# EAGLE design Ad8232_placa_V2 (EAGLE 9.6.2)
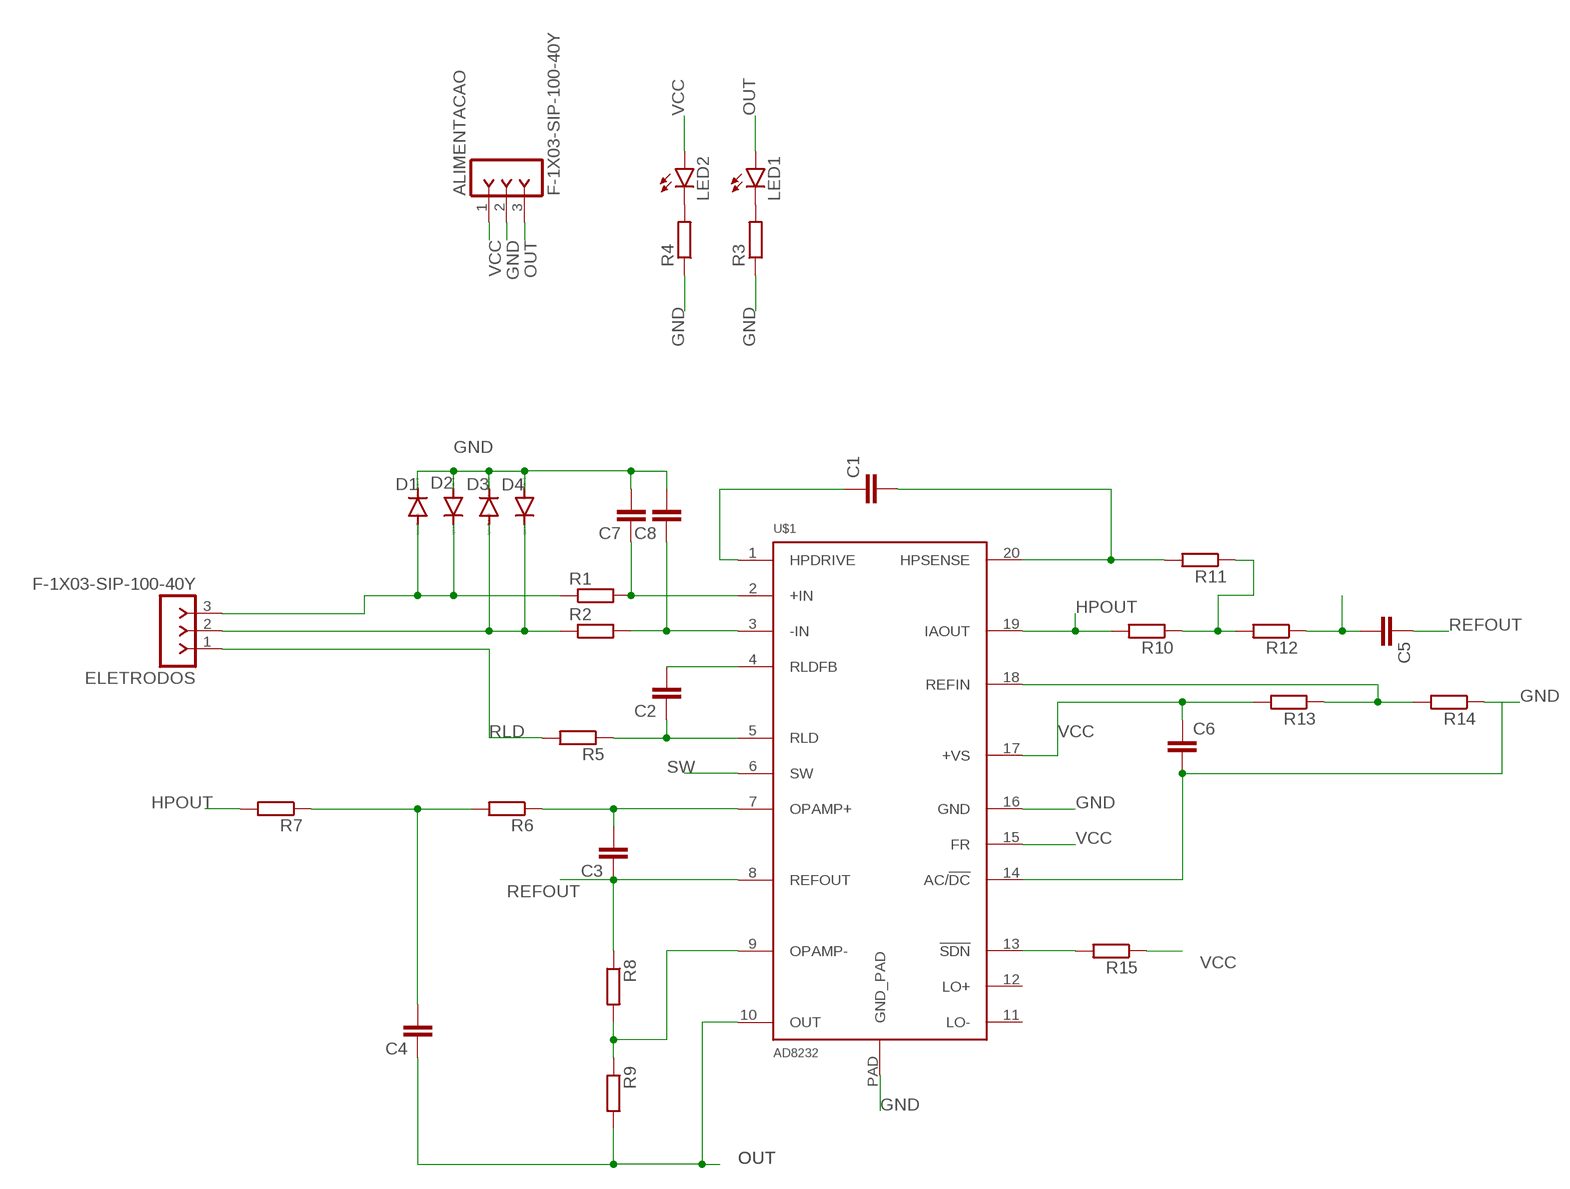
[diagram p0: schematic, sheet 1]

## Parts
ALIMENTACAO  F-1X03-SIP-100-40Y  [SIP-100-03-40Y]
C1  C-EUC0805  [C0805]
C2  C-EUC0805  [C0805]
C3  C-EUC0805  [C0805]
C4  C-EUC0805  [C0805]
C5  C-EUC0805  [C0805]
C6  C-EUC0805  [C0805]
C7  C-EUC0805  [C0805]
C8  C-EUC0805  [C0805]
D1  DIODE-MINIMELF  [MINIMELF]
D2  DIODE-MINIMELF  [MINIMELF]
D3  DIODE-MINIMELF  [MINIMELF]
D4  DIODE-MINIMELF  [MINIMELF]
ELETRODOS  F-1X03-SIP-100-40Y  [SIP-100-03-40Y]
LED1  LEDCHIPLED_0603  [CHIPLED_0603]
LED2  LEDCHIPLED_0603  [CHIPLED_0603]
R1  R-EU_R0805  [R0805]
R2  R-EU_R0805  [R0805]
R3  R-EU_R0805  [R0805]
R4  R-EU_R0805  [R0805]
R5  R-EU_R0805  [R0805]
R6  R-EU_R0805  [R0805]
R7  R-EU_R0805  [R0805]
R8  R-EU_R0805  [R0805]
R9  R-EU_R0805  [R0805]
R10  R-EU_R0805  [R0805]
R11  R-EU_R0805  [R0805]
R12  R-EU_R0805  [R0805]
R13  R-EU_R0805  [R0805]
R14  R-EU_R0805  [R0805]
R15  R-EU_R0805  [R0805]
U$1  AD8232  [LFCSP_20]

## Nets
GND: ALIMENTACAO.2 C6.2 C7.2 C8.2 D1.C D2.A D3.C D4.A R3.1 R4.1 R14.1 U$1.14(AC/!DC) U$1.16(GND) U$1.PAD(GND_PAD)
HPOUT: R7.2 R10.2 U$1.19(IAOUT)
N$1: C1.1 U$1.1(HPDRIVE)
N$2: C1.2 R11.2 U$1.20(HPSENSE)
N$3: C7.1 R1.2 U$1.2(+IN)
N$4: C8.1 R2.2 U$1.3(-IN)
N$5: D1.A D2.C ELETRODOS.3 R1.1
N$6: D3.A D4.C ELETRODOS.2 R2.1
N$7: C2.2 U$1.4(RLDFB)
N$8: C2.1 R5.1 U$1.5(RLD)
N$9: C3.2 R6.1 U$1.7(OPAMP+)
N$10: R13.1 R14.2 U$1.18(REFIN)
N$11: R8.2 R9.1 U$1.9(OPAMP-)
N$12: LED1.C R3.2
N$13: R10.1 R11.1 R12.2
N$14: C4.2 R6.2 R7.1
N$15: LED2.C R4.2
N$16: R15.2 U$1.13(!SDN)
OUT: ALIMENTACAO.3 C4.1 LED1.A R9.2 U$1.10(OUT)
REFOUT: C3.1 C5.1 R8.1 U$1.8(REFOUT)
RLD: ELETRODOS.1 R5.2
SW: C5.2 R12.1 U$1.6(SW)
VCC: ALIMENTACAO.1 C6.1 LED2.A R13.2 R15.1 U$1.15(FR) U$1.17(+VS)
Unconnected: U$1.11(LO-) U$1.12(LO+)

## Library data of the parts
ALIMENTACAO ELETRODOS = con-headers-jp:F-1X03-: FEMALE HEADER
C1-C8 = rcl:C-EU: CAPACITOR, European symbol
D1-D4 = diode:DIODE-: DIODE
LED1 LED2 = led:LED: LED OSRAM: - CHIPLED LG R971, LG N971, LY N971, LG Q971, LY Q971, LO R971, LY R971 LH N974, LH R974 LS Q976, LO Q976, LY Q976 LO Q996 - Hyper CHIPLED LW Q18S LB Q993, LB Q99A, LB R99A - SideLED LS A670, LO A670, LY A670, LG A670, LP A670 LB A673, LV A673, LT A673, LW A673 LH A674 LY A675 LS A676, LA A676, LO A676, LY A676, LW A676 LS A679, LY A679, LG A679 - Hyper Micro SIDELED® LS Y876, LA Y876, LO Y876, LY Y876 LT Y87S - SmartLED LW L88C, LW L88S LB L89C, LB L89S, LG L890 LS L89K, LO L89K, LY L89K LS L896, LA L896, LO L896, LY L896 - TOPLED LS T670, LO T670, LY T670, LG T670, LP T670 LSG T670, LSP T670, LSY T670, LOP T670, LYG T670 LG T671, LOG T671, LSG T671 LB T673, LV T673, LT T673, LW T673 LH T674 LS T676, LA T676, LO T676, LY T676, LB T676, LH T676, LSB T676, LW T676 LB T67C, LV T67C, LT T67C, LS T67K, LO T67K, LY T67K, LW E67C LS E67B, LA E67B, LO E67B, LY E67B, LB E67C, LV E67C, LT E67C LW T67C LS T679, LY T679, LG T679 LS T770, LO T770, LY T770, LG T770, LP T770 LB T773, LV T773, LT T773, LW T773 LH T774 LS E675, LA E675, LY E675, LS T675 LS T776, LA T776, LO T776, LY T776, LB T776 LHGB T686 LT T68C, LB T68C - Hyper Mini TOPLED® LB M676 - Mini TOPLED Santana® LG M470 LS M47K, LO M47K, LY M47K Source: http://www.osram.convergy.de LUXEON: - LUMILED® LXK2-PW12-R00, LXK2-PW12-S00, LXK2-PW14-U00, LXK2-PW14-V00 LXK2-PM12-R00, LXK2-PM12-S00, LXK2-PM14-U00 LXK2-PE12-Q00, LXK2-PE12-R00, LXK2-PE12-S00, LXK2-PE14-T00, LXK2-PE14-U00 LXK2-PB12-K00, LXK2-PB12-L00, LXK2-PB12-M00, LXK2-PB14-N00, LXK2-PB14-P00, LXK2-PB14-Q00 LXK2-PR12-L00, LXK2-PR12-M00, LXK2-PR14-Q00, LXK2-PR14-R00 LXK2-PD12-Q00, LXK2-PD12-R00, LXK2-PD12-S00 LXK2-PH12-R00, LXK2-PH12-S00 LXK2-PL12-P00, LXK2-PL12-Q00, LXK2-PL12-R00 Source: www.luxeon.com KINGBRIGHT: KA-3528ASYC Source: www.kingbright.com
R1-R15 = rcl:R-EU_: RESISTOR, European symbol
U$1 = AD8232:AD8232: Check prices <https://pricing.snapeda.com/parts/AD8232/Analog%20Devices/view-part?ref=eda>; AVAILABILITY: Not in stock; DESCRIPTION: AD8232 Sensor Signal Conditioner Interface Evaluation Board; MF: Analog Devices; MP: AD8232; PACKAGE: LFCSP-20 Analog Devices; PRICE: None

## Board
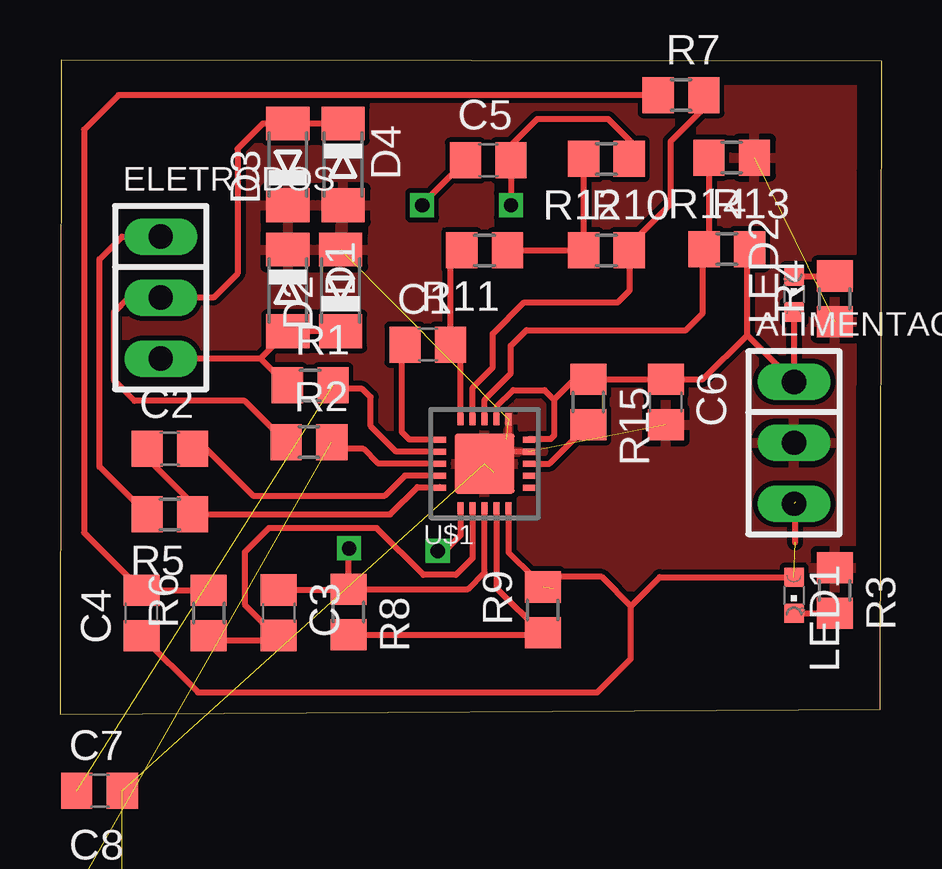
[diagram p1: board, top side]
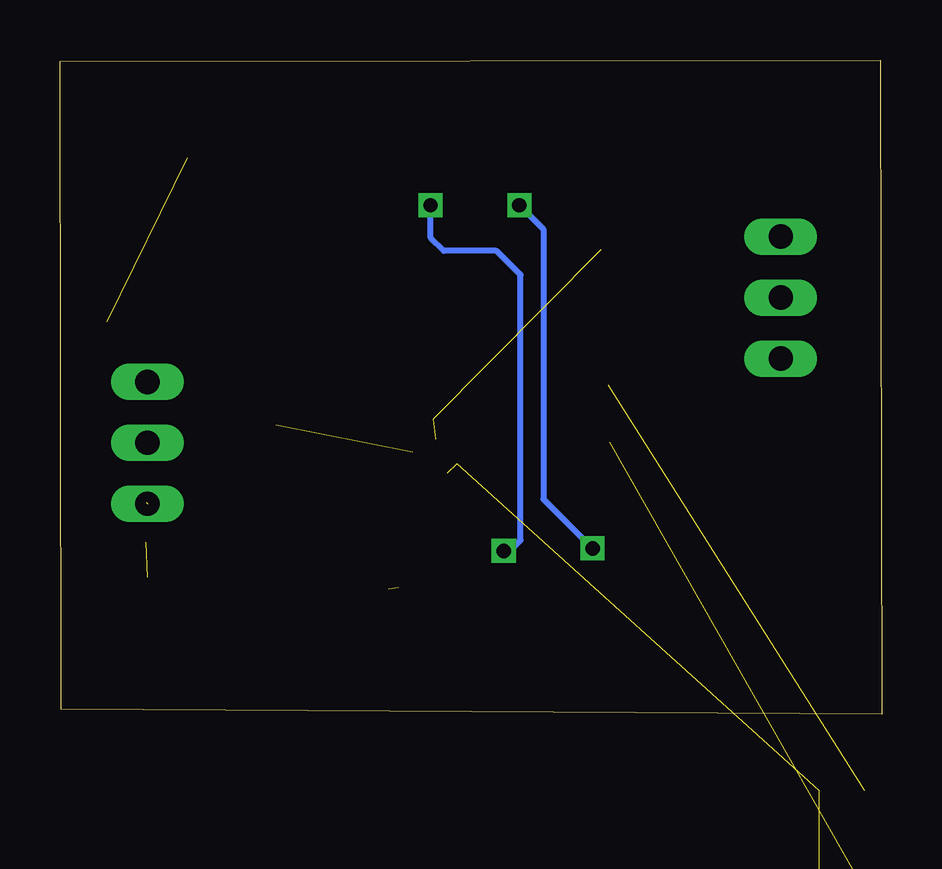
[diagram p2: board, bottom side, seen from below]

Size 34.25 x 27.25 mm. Coordinates in mm from the lower left corner, seen from the top.
Outline: 0,0 34.2,0.2 34.25,27.2 0.05,27.25 0,0
Copper layers (1*16): Top 0.035mm / dielectric 1.5mm / Bottom 0.035mm
Design rules "default": minimum track width 10mil, minimum drill 24mil, track to track 8mil, track to pad 8mil, pad to pad 8mil, via to via 8mil, smd to smd 8mil, copper to edge 40mil, drill to drill 8mil, minimum pad ring 10mil, minimum via ring 8mil, stop-mask expansion 4mil, vias tented up to drill 0mil, thermal gap 10mil

### Footprints (pad centres in the part's own frame; a part is rotated, then mirrored left to right if it is on the bottom)
SIP-100-03-40Y = drill 1.016 long: 1 -2.54,0; 2 0,0; 3 2.54,0
C0805 = smd 1.3 x 1.5: 1 -0.95,0; 2 0.95,0
MINIMELF = smd 1.4 x 1.8: A 1.7,0; C -1.7,0
CHIPLED_0603 = smd 0.8 x 0.8: A 0,-0.75; C 0,0.75
R0805 = smd 1.3 x 1.5: 1 -0.95,0; 2 0.95,0
LFCSP_20 = smd 0.5 x 0.25: 1 -1.85,1; 2 -1.85,0.5; 3 -1.85,0; 4 -1.85,-0.5; 5 -1.85,-1; 11 1.85,-1; 12 1.85,-0.5; 13 1.85,0; 14 1.85,0.5; 15 1.85,1 | smd 0.25 x 0.5: 6 -1,-1.85; 7 -0.5,-1.85; 8 0,-1.85; 9 0.5,-1.85; 10 1,-1.85; 16 1,1.85; 17 0.5,1.85; 18 0,1.85; 19 -0.5,1.85; 20 -1,1.85 | smd 2.5 x 2.5: PAD 0,0

### Placement (x,y rotation side)
ALIMENTACAO  30.6,11.3 270 top
C1  15.33,15.39 0 top
C2  4.58,11.05 0 top
C3  9.12,4.22 270 top
C4  3.4,4.21 90 top
C5  17.85,23.07 0 top
C6  25.25,13 270 top
C7  1.65,-3.2 0 top  (outside the outline)
C8  1.65,-7.35 0 top  (outside the outline)
D1  9.5,17.65 270 top
D2  11.7,17.65 90 top
D3  9.5,22.9 90 top
D4  11.8,22.9 270 top
ELETRODOS  4.2,17.35 270 top
LED1  30.6,4.95 180 top
LED2  30.6,17.5 0 top
R1  10.43,13.69 0 top
R2  10.38,11.33 0 top
R3  32.3,5.15 270 top
R4  32.3,17.3 90 top
R5  4.58,8.32 180 top
R6  6.2,4.21 90 top
R7  25.89,25.79 0 top
R8  12.03,4.25 270 top
R9  20.13,4.34 90 top
R10  22.78,19.32 0 top
R11  17.7,19.32 180 top
R12  22.78,23.13 180 top
R13  27.8,19.37 0 top
R14  28,23.18 180 top
R15  22.03,13 270 top
U$1  17.7,10.43 0 top

### Tracks (layer width: path | path; a pad name or v marks a point on that pad's centre or on a via)
GND  (7 unrouted)
  Top 0.254: 18.6,11.45 18.5,11.35 | 18.1,10.05 18.1,10.7 18.33,10.93 U$1.14 | U$1.16 18.7,11.43 U$1.PAD
  pour Top: -0.25,27.3 34.3,27.3 34.3,0.15 -0.25,0.15
HPOUT
  Top 0.254: U$1.19 17.2,13.6 18.05,14.45 18.05,15.85 19.35,17.15 23.25,17.15 23.75,17.65 23.75,19.3 R10.2 23.65,19.4 23.65,19.45 25.45,21.25 25.45,23.85 26.84,25.24 R7.2
N$1
  Top 0.254: U$1.1 14.57,11.43 14.25,11.75 14.25,15.26 C1.1
N$2
  Top 0.254: U$1.20 16.7,14.97 C1.2 16.28,18.85 R11.2
N$3  (1 unrouted)
  Top 0.254: U$1.2 14.02,10.93 12.95,12 12.95,13.2 12.6,13.55 11.52,13.55 R1.2
N$4  (1 unrouted)
  Top 0.254: U$1.3 13.27,10.43 12.65,11.05 11.61,11.05 R2.2
N$5
  Top 0.254: 8.35,14.81 8.36,14.81 R1.1 | 8.35,14.81 ELETRODOS.3 | D2.C D1.A 8.35,14.81
N$6
  Top 0.254: R2.1 7.7,13.05 3.1,13.05 2.25,13.9 2.25,16.75 2.85,17.35 ELETRODOS.2 6.4,17.35 7.4,18.35 7.4,23.55 8.45,24.6 D3.A D4.C
N$7
  Top 0.254: C2.2 6.1,11.05 8.05,9.1 13.55,9.1 14.38,9.93 U$1.4
N$8
  Top 0.254: U$1.5 15.83,9.45 14.9,9.45 13.77,8.32 R5.1 5.53,8.77 3.6,10.7 3.6,11.02 C2.1
N$9
  Top 0.254: R6.1 6.4,3.06 9.2,3.06 | 9.2,3.06 9.3,3.06 9.3,3.09 C3.2 | U$1.7 17.2,6.5 16.5,5.8 15.15,5.8 13.2,7.75 8.7,7.75 7.7,6.75 7.7,4.56 9.2,3.06
N$10
  Top 0.254: R14.2 27.05,19.57 R13.1 26.8,19.32 26.8,16.7 26.1,16 19.45,16 18.8,15.35 18.8,14.2 17.7,13.1 U$1.18
N$11
  Top 0.254: R8.2 20.04,3.3 20.09,3.35 | 20.09,3.35 R9.1 | U$1.9 18.2,5.25 20.09,3.35
N$12
  Top 0.254: LED1.C R3.2
N$13
  Top 0.254: R12.2 R10.1 R11.1
N$14
  Top 0.254: R6.2 C4.2 1,7.56 1,24.35 2.44,25.79 R7.1
N$15
  Top 0.254: LED2.C R4.2
N$16
  Top 0.254: U$1.13 20.41,10.43 R15.2
OUT  (3 unrouted)
  Top 0.254: 20.55,5.8 20.55,5.22 | C4.1 5.75,0.9 22.4,0.9 23.8,2.3 23.8,4.5 | 30.65,7.15 30.65,8.83 | U$1.10 18.7,6.72 19.71,5.71 | 19.71,5.71 R9.2 | 23.8,4.5 25,5.7 LED1.A | 23.8,4.5 22.59,5.71 19.71,5.71
REFOUT  (via drill 0.6)
  Top 0.254: C5.1 16.9,23.05 15.1,21.25 v15.1,21.2 | 9.14,5.15 C3.1 12,5.17 R8.1 | R8.1 12.03,6.88 v12.05,6.9 | R8.1 17,5.2 17.7,5.9 U$1.8
  Bottom 0.254: v15.1,21.2 14.1,20.2 14.1,8.95 v12.05,6.9
RLD
  Top 0.254: R5.2 1.65,10.3 1.65,18.95 2.59,19.89 ELETRODOS.1
SW  (via drill 0.6)
  Top 0.254: R12.1 23.9,23.3 23.9,23.75 22.85,24.8 19.9,24.8 18.8,23.7 C5.2 v18.8,21.2 | U$1.6 16.7,7.45 16.05,6.8 v15.75,6.8
  Bottom 0.254: v15.75,6.8 15.5,6.8 15.05,7.25 15.05,18.3 16.05,19.3 18.25,19.3 18.8,19.85 v18.8,21.2
VCC
  Top 0.254: 28.65,15.79 28.65,19.27 R13.2 | U$1.17 18.2,12.8 18.9,13.5 20.2,13.5 20.6,13.1 | 20.6,13.1 20.6,11.6 20.45,11.45 19.57,11.45 U$1.15 | 20.6,13.1 21.45,13.95 R15.1 C6.1 | C6.1 25.85,13.95 | 28.65,15.79 ALIMENTACAO.1 LED2.A | C6.1 26.81,13.95 28.65,15.79